# Altium schematic sheet interfaces.SchDoc: External Interfaces
size A4; Organization: heig-vd; Address1: heig-vd; Address2: Route de Cheseaux 1; Address3: 1401 Yverdon-les-Bains; Address4: Suisse; Revision: 1.0
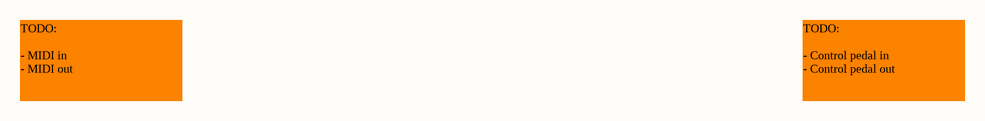
[diagram p0: interfaces.SchDoc]

## Notes on the sheet
- TODO:
  - MIDI in
  - MIDI out
- TODO:
  - Control pedal in
  - Control pedal out
- Route de Cheseaux 1
- CH-1401 Yverdon-les-Bains
- Titre:
- Date:
- Projet:
- Revision:
- Sheet
- of
- File: